# EAGLE design GucciAux (EAGLE 9.1.0)
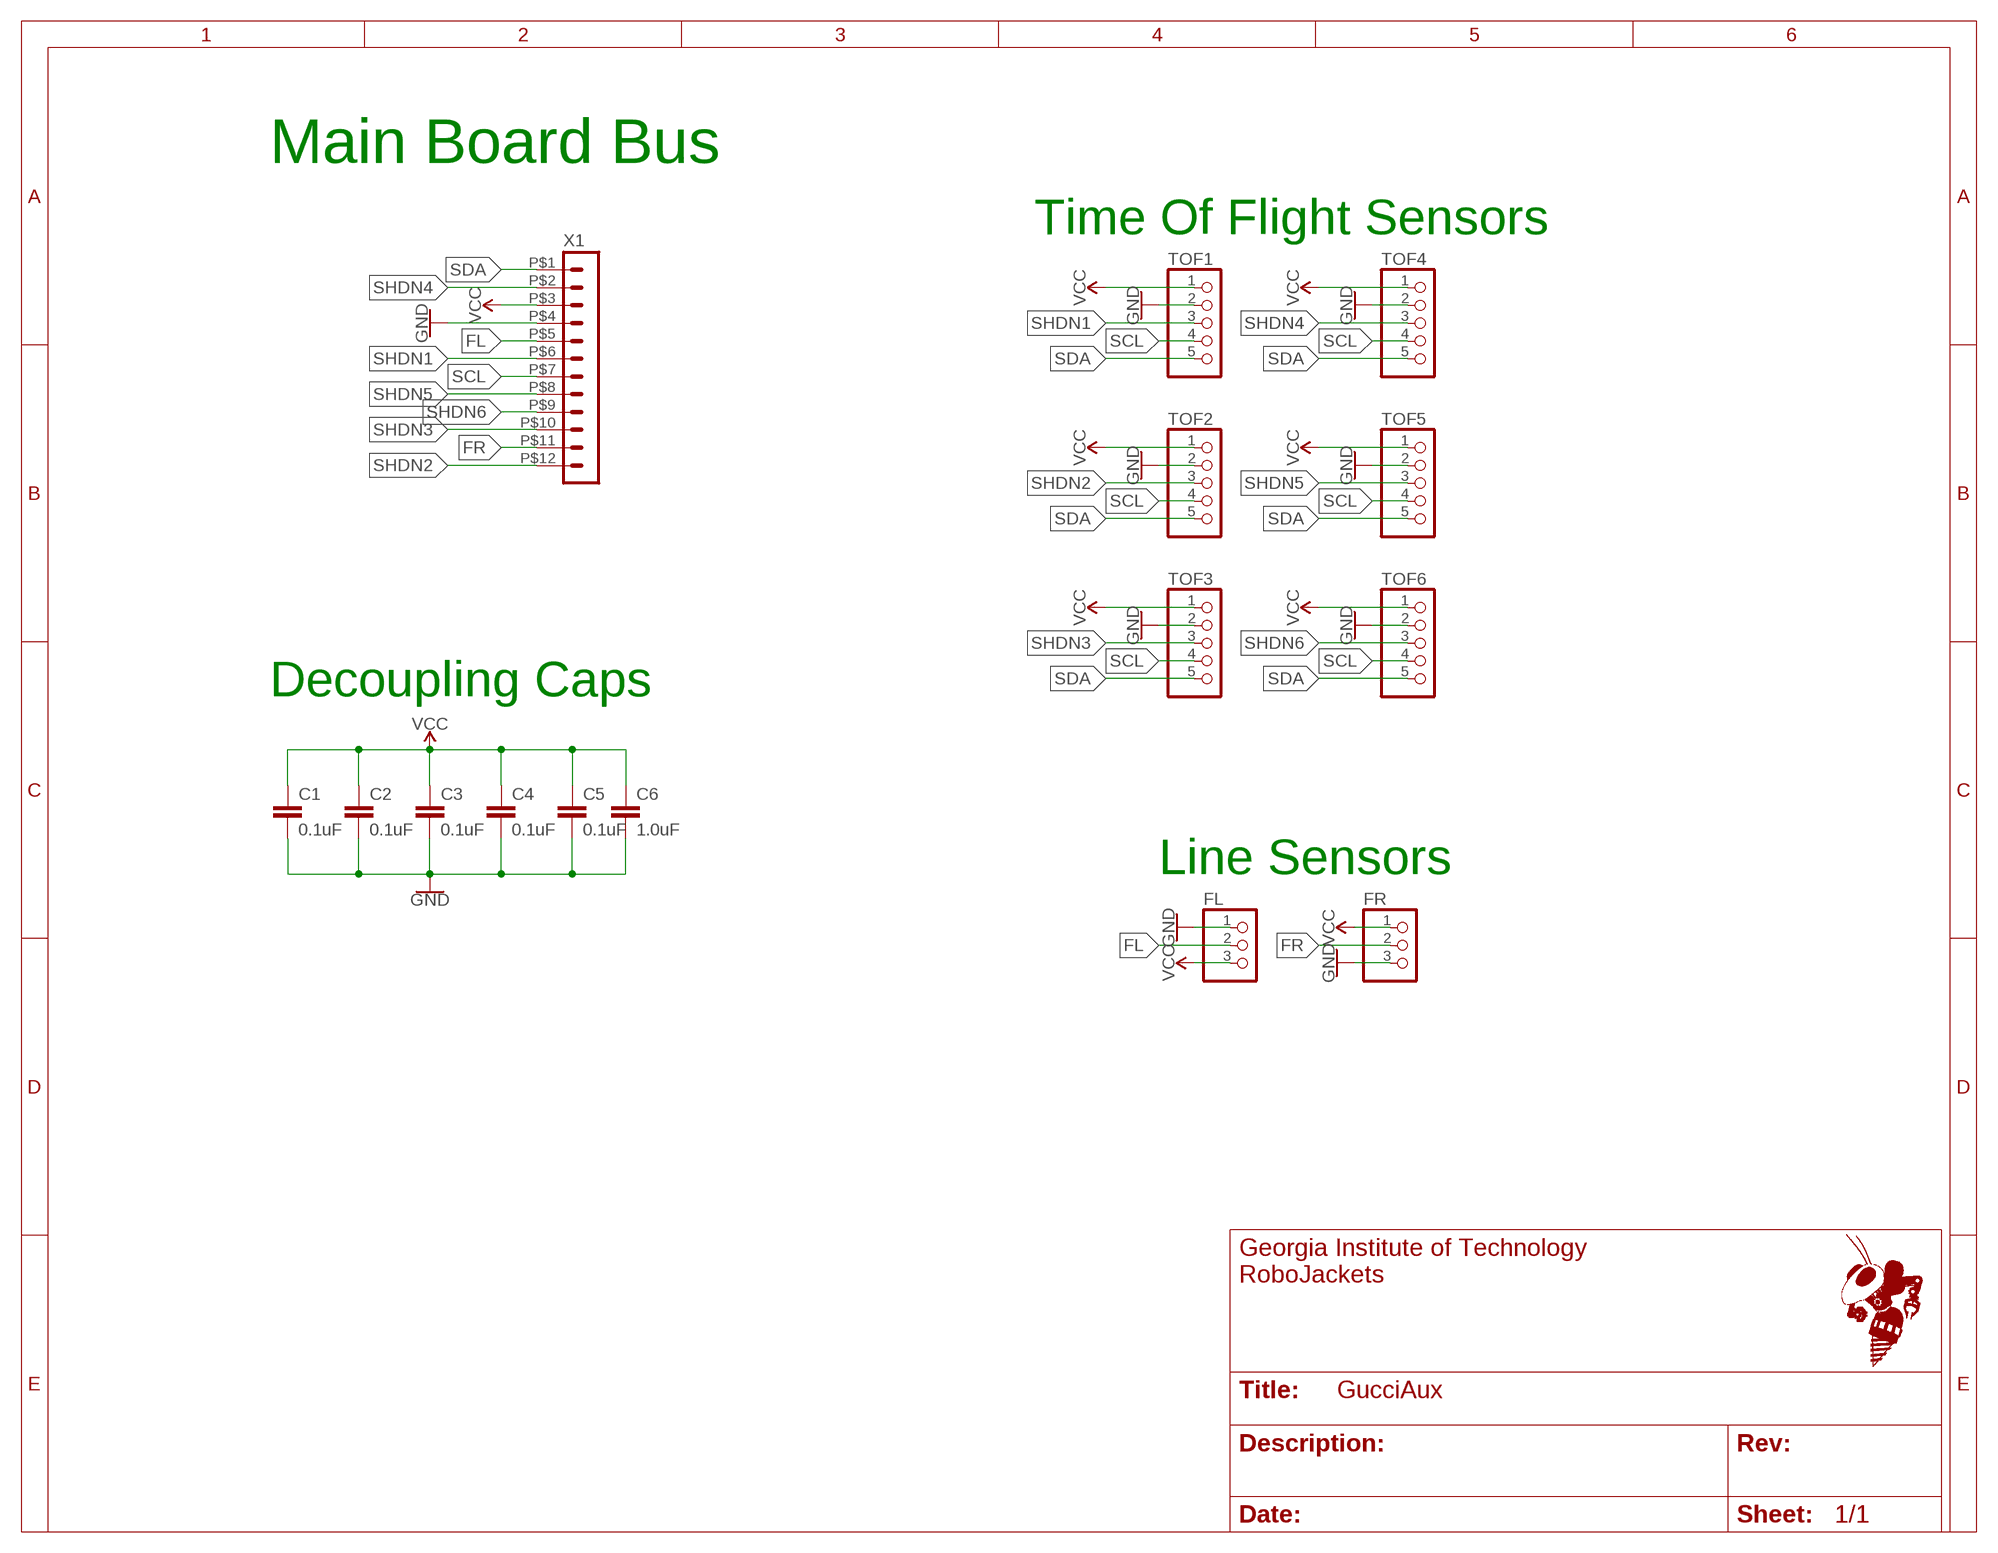
[diagram p0: schematic, sheet 1]

## Parts
C1  0.1uF  0.1UF-0603-25V-(+80/-20%)  [0603]
C2  0.1uF  0.1UF-0603-25V-(+80/-20%)  [0603]
C3  0.1uF  0.1UF-0603-25V-(+80/-20%)  [0603]
C4  0.1uF  0.1UF-0603-25V-(+80/-20%)  [0603]
C5  0.1uF  0.1UF-0603-25V-(+80/-20%)  [0603]
C6  1.0uF  1.0UF-0603-16V-10%  [0603]
FL  PINHD-1X3  [1X03]
FR  PINHD-1X3  [1X03]
TOF1  PINHD-1X5  [1X05]
TOF2  PINHD-1X5  [1X05]
TOF3  PINHD-1X5  [1X05]
TOF4  PINHD-1X5  [1X05]
TOF5  PINHD-1X5  [1X05]
TOF6  PINHD-1X5  [1X05]
X1  HEADER_POS12_43045-1212  [43045-1212]

## Nets
FL: FL.2 X1.P$5
FR: FR.2 X1.P$11
GND: C1.2 C2.2 C3.2 C4.2 C5.2 C6.2 FL.1 FR.3 TOF1.2 TOF2.2 TOF3.2 TOF4.2 TOF5.2 TOF6.2 X1.P$4
SCL: TOF1.4 TOF2.4 TOF3.4 TOF4.4 TOF5.4 TOF6.4 X1.P$7
SDA: TOF1.5 TOF2.5 TOF3.5 TOF4.5 TOF5.5 TOF6.5 X1.P$1
SHDN1: TOF1.3 X1.P$6
SHDN2: TOF2.3 X1.P$12
SHDN3: TOF3.3 X1.P$10
SHDN4: TOF4.3 X1.P$2
SHDN5: TOF5.3 X1.P$8
SHDN6: TOF6.3 X1.P$9
VCC: C1.1 C2.1 C3.1 C4.1 C5.1 C6.1 FL.3 FR.1 TOF1.1 TOF2.1 TOF3.1 TOF4.1 TOF5.1 TOF6.1 X1.P$3

## Notes on the sheet
- Main Board Bus
- Time Of Flight Sensors
- Decoupling Caps
- Line Sensors

## Library data of the parts
C1-C5 = SparkFun-Capacitors:0.1UF: 0.1µF ceramic capacitors A capacitor is a passive two-terminal electrical component used to store electrical energy temporarily in an electric field.; PROD_ID: CAP-00810
C6 = SparkFun-Capacitors:1.0UF: 1µF ceramic capacitors A capacitor is a passive two-terminal electrical component used to store electrical energy temporarily in an electric field.; PROD_ID: CAP-00868
FL FR = pinhead:PINHD-1X3: PIN HEADER
TOF1-TOF6 = pinhead:PINHD-1X5: PIN HEADER
X1 = con-molex-micro-fit-3_0:HEADER_POS12_?: Molex - Micro-Fit 3.0 Series connector, 3.00mm (0.118") pitch header, 12 positions.

## Board
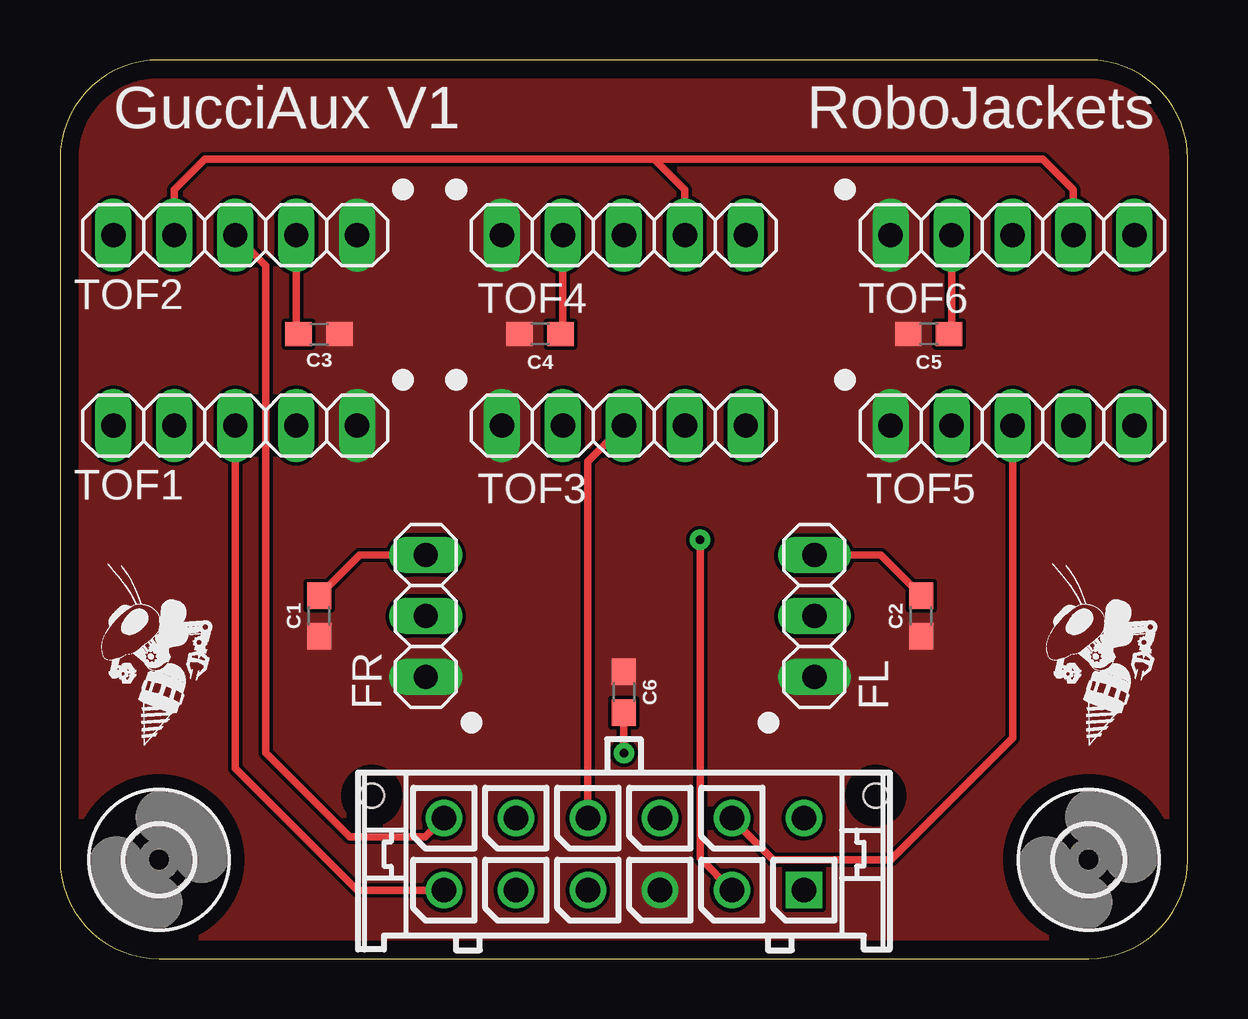
[diagram p1: board, top side]
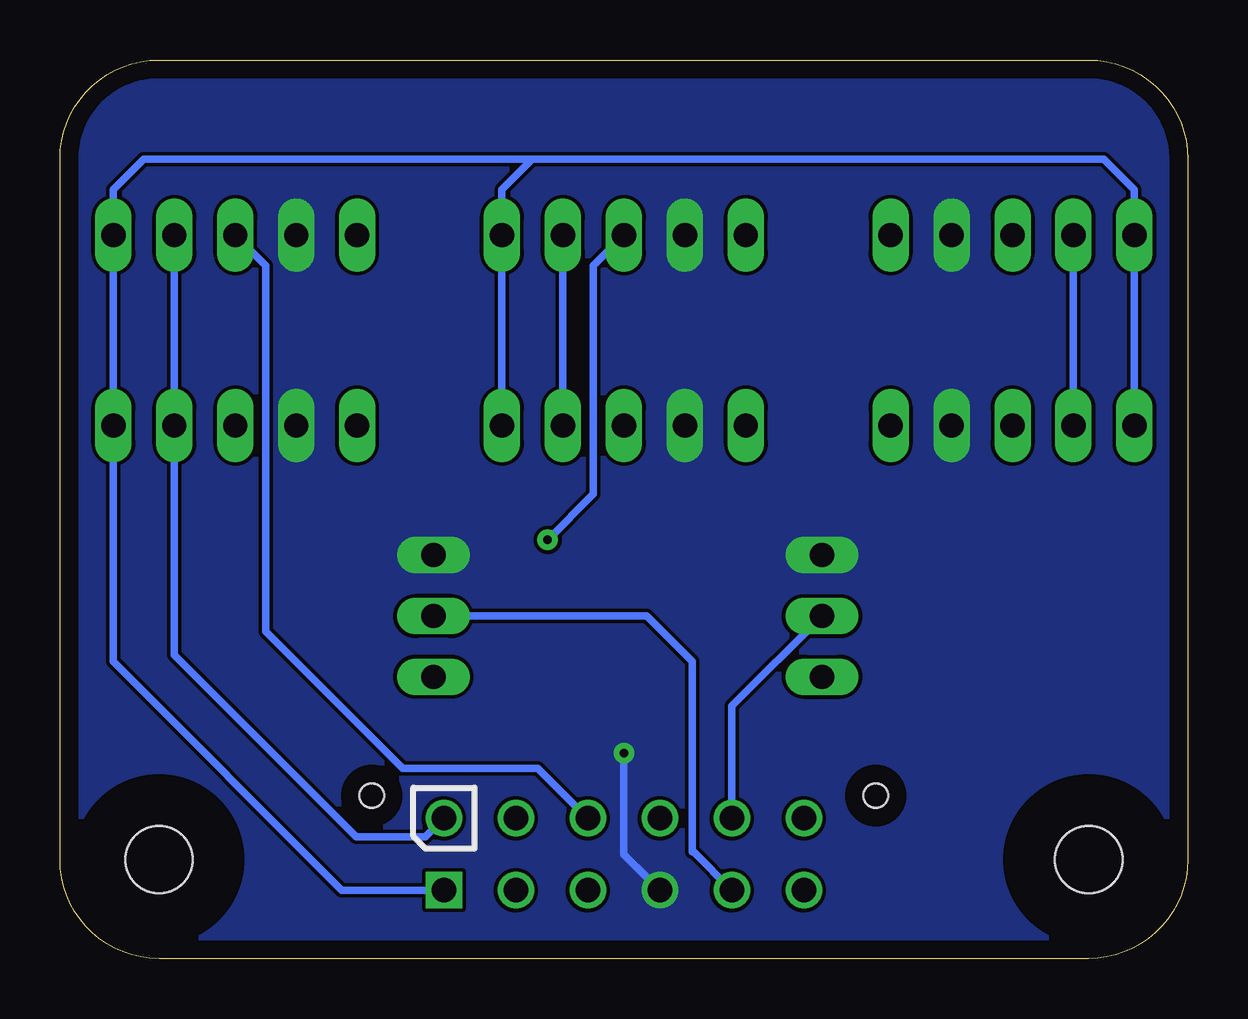
[diagram p2: board, bottom side, seen from below]

Size 46.99 x 37.47 mm. Coordinates in mm from the lower left corner, seen from the top.
Outline: 4.13,0 42.86,0 arc90 46.99,4.13 46.99,33.34 arc90 42.86,37.47 4.13,37.47 arc90 0,33.34 0,4.13 arc90 4.13,0
Copper layers (1*16): Top 0.035mm / dielectric 1.5mm / Bottom 0.035mm
Design rules "Gucci_DRC *": minimum track width 6mil, minimum drill 0.35mm, track to track 6mil, track to pad 6mil, pad to pad 6mil, via to via 6mil, smd to smd 6mil, copper to edge 30mil, drill to drill 6mil, minimum pad ring 10mil, minimum via ring 10mil, stop-mask expansion 4mil, vias tented up to drill 15mil, thermal gap 10mil

### Footprints (pad centres in the part's own frame; a part is rotated, then mirrored left to right if it is on the bottom)
0603 = smd 1.1 x 1: 1 -0.85,0; 2 0.85,0
1X03 = drill 1.016 long: 1 -2.54,0; 2 0,0; 3 2.54,0
1X05 = drill 1.016 long: 1 -5.08,0; 2 -2.54,0; 3 0,0; 4 2.54,0; 5 5.08,0
2,8 = hole 2.8: 0,0
43045-1212 = drill 1.02 square: P$1 7.5,0 | drill 1.02: P$2 4.5,0; P$3 1.5,0; P$4 -1.5,0; P$5 -4.5,0; P$6 -7.5,0; P$7 7.5,3; P$8 4.5,3; P$9 1.5,3; P$10 -1.5,3; P$11 -4.5,3; P$12 -7.5,3 | hole 1.02: 10.5,3.94; -10.5,3.94

### Placement (x,y rotation side)
C1  10.79,14.29 90 top
C2  35.88,14.29 90 top
C3  10.79,26.04 180 top
C4  20,26.04 0 top
C5  36.2,26.04 0 top
C6  23.5,11.11 270 top
FL  31.43,14.29 270 top
FR  15.24,14.29 90 top
TOF1  7.3,22.23 180 top
TOF2  7.3,30.16 180 top
TOF3  23.5,22.23 0 top
TOF4  23.5,30.16 0 top
TOF5  39.69,22.23 0 top
TOF6  39.69,30.16 0 top
U$1  [ROBOBUZZ_0.4X]  3.49,8.89 0 top
U$2  [ROBOBUZZ_0.4X]  42.86,8.89 0 top
U$3  [2,8]  4.13,4.13 0 top
U$4  [2,8]  42.86,4.13 0 top
X1  23.5,2.86 0 top

### Tracks (layer width: path | path; a pad name or v marks a point on that pad's centre or on a via)
FL
  Bottom 0.305: X1.P$5 20.58,4.45 20.64,4.45 20.64,12.38 22.54,14.29 FL.2
FR
  Bottom 0.305: FR.2 19,10.53 X1.P$11
GND  (via drill 0.35)
  Top 0.305: TOF6.2 37.15,26.14 C5.2 | TOF4.2 20.95,26.14 C4.2 | TOF2.2 9.84,26.14 C3.2 | C1.2 12.48,16.83 FR.3 | FL.1 34.19,16.83 C2.2 | v23.5,8.57 C6.2
  Bottom 0.305: X1.P$4 23.5,4.36 v23.5,8.57
  pour Bottom (no thermals): 0,0 46.99,-0.13 47,37.43 0.09,37.36
SCL
  Top 0.305: TOF6.4 42.23,32.07 40.96,33.34 24.77,33.34 | TOF4.4 26.04,32.07 24.77,33.34 | TOF2.4 4.76,32.07 6.03,33.34 24.77,33.34
  Bottom 0.305: X1.P$7 31.77,5.08 34.65,5.08 42.23,12.66 TOF5.4 TOF6.4 | TOF3.4 TOF4.4 | TOF1.4 TOF2.4
SDA
  Bottom 0.305: X1.P$1 35.24,2.86 44.77,12.38 TOF5.5 TOF6.5 44.77,32.07 43.5,33.34 27.3,33.34 | 27.3,33.34 28.57,32.07 TOF4.5 TOF3.5 | 27.3,33.34 3.49,33.34 2.22,32.07 TOF2.5 TOF1.5
SHDN1
  Top 0.305: TOF1.3 7.3,7.94 12.38,2.86 X1.P$6
SHDN2
  Top 0.305: TOF2.3 8.57,28.89 8.57,8.57 12.06,5.08 15.22,5.08 X1.P$12
SHDN3
  Top 0.305: X1.P$10 22,20.73 TOF3.3
SHDN4  (via drill 0.35)
  Top 0.305: X1.P$2 26.67,4.18 v26.67,17.46
  Bottom 0.305: TOF4.3 24.77,28.89 24.77,19.37 v26.67,17.46
SHDN5
  Top 0.305: X1.P$8 29.73,4.13 34.61,4.13 39.69,9.21 TOF5.3
SHDN6
  Bottom 0.305: X1.P$9 27.07,7.94 32.7,7.94 38.42,13.65 38.42,28.89 TOF6.3
VCC
  pour Top (no thermals): 0,37.47 0.08,0 46.89,-0.03 46.99,37.6

### Text on the board
tPlace: GucciAux V1 | RoboJackets